# EAGLE design wt41_uart_breakout_board_v21 (EAGLE 6.5.0)
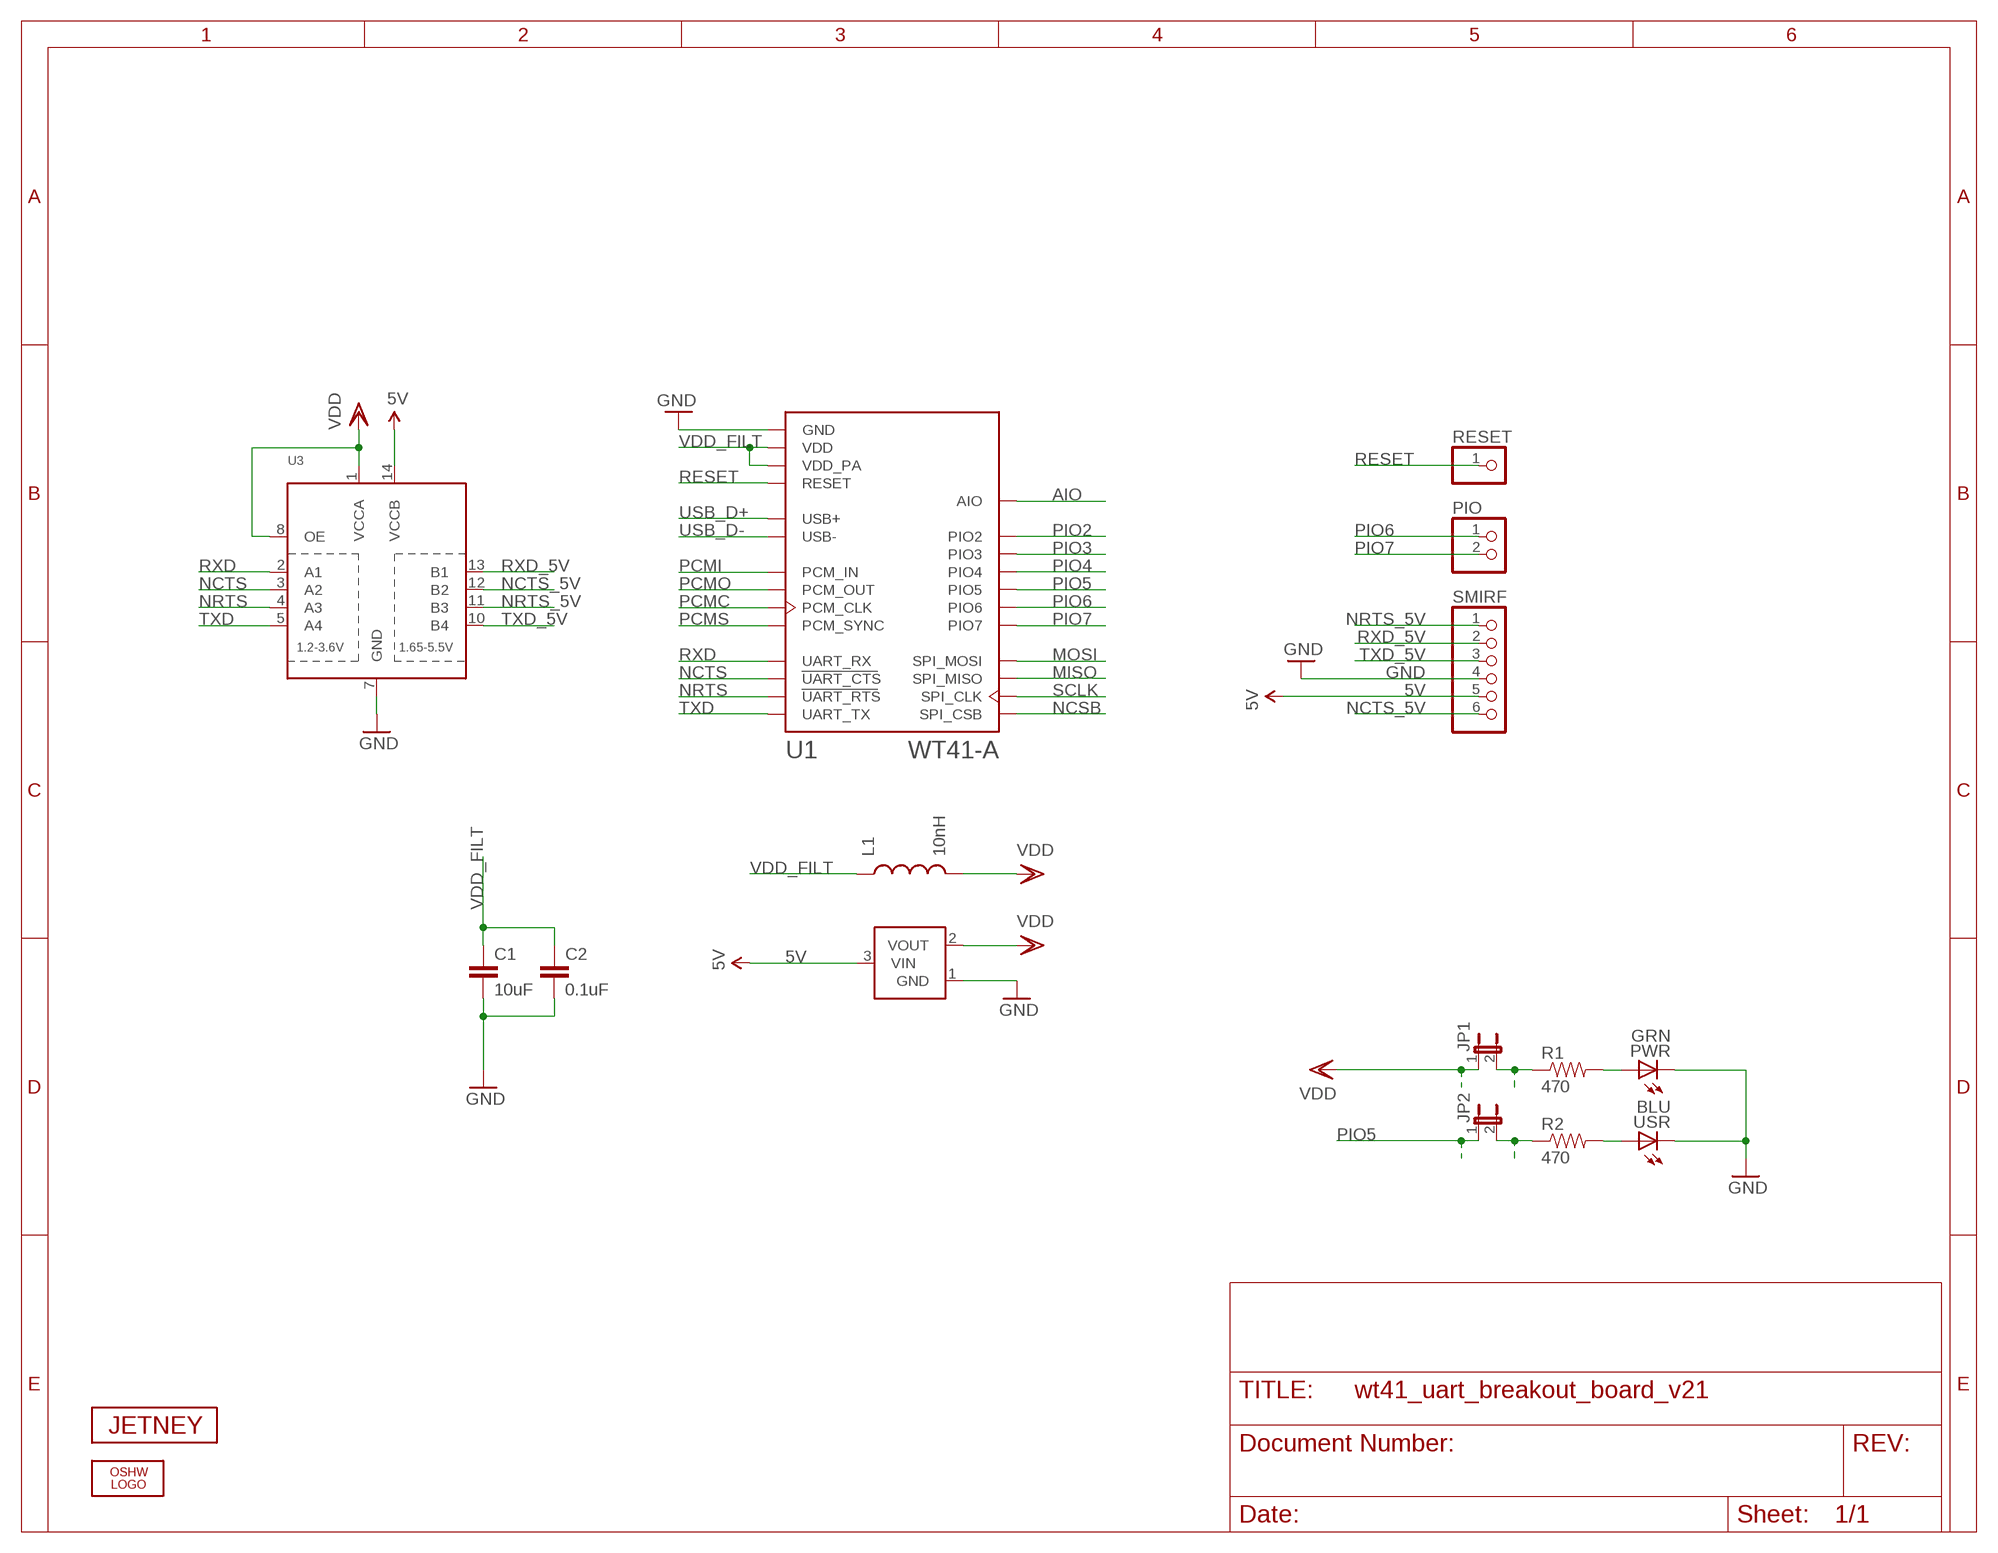
[diagram p0: schematic, sheet 1]

## Parts
C1  10uF  CAP0603-CAP  [0603-CAP]
C2  0.1uF  CAP0603-CAP  [0603-CAP]
JP1  JUMPER-2SMD-NC  [SJ_2S]
JP2  JUMPER-2SMD-NC  [SJ_2S]
L1  10nH  INDUCTOR0603  [0603]
LOGO1  OSHW_LOGO_FILLX0070-NT  [OSHW_FILLX70_NOTEXT]
PIO  PINHD-1X2  [1X02]
PWR  GRN  LEDCHIPLED_0805  [CHIPLED_0805]
R1  470  RESISTOR0603-RES  [0603-RES]
R2  470  RESISTOR0603-RES  [0603-RES]
RESET  PINHD-1X1  [1X01]
SMIRF  PINHD-1X6  [1X06]
U1  WT41-A  [WT41-A]
U2  MCP1700  [SOT23-3]
U3  TXB0104PWR  [TSSOP14]
U$4  JETNEY-LOGO-12  [JETNEY-LOGO-12]
USR  BLU  LEDCHIPLED_0805  [CHIPLED_0805]

## Nets
5V [power]: SMIRF.5 U2.3(VIN) U3.14(VCCB)
AIO: U1.AIO
GND [power]: C1.2 C2.2 PWR.C SMIRF.4 U1.GND U1.GND@2(GND) U1.GND@3(GND) U1.GND@4(GND) U1.GND@5(GND) U1.GND@6(GND) U1.GND@7(GND) U1.GND@8(GND) U1.GND@9(GND) U1.GND@10(GND) U1.GND@11(GND) U1.GND@12(GND) U1.GND@13(GND) U1.GND@14(GND) U1.GND@15(GND) U1.GND@16(GND) U1.GND@17(GND) U1.GND@18(GND) U1.GND@19(GND) U1.GND@20(GND) U1.GND@21(GND) U1.GND@22(GND) U1.GND@23(GND) U1.GND@24(GND) U1.GND@25(GND) U1.GND@26(GND) U1.GND@27(GND) U1.GND@28(GND) U1.GND@29(GND) U1.GND@30(GND) U1.GND@31(GND) U2.1(GND) U3.7(GND) USR.C
MISO: U1.SPI_MISO
MOSI: U1.SPI_MOSI
N$1: PWR.A R1.2
N$3: R2.2 USR.A
N$4: JP2.2 R2.1
NCSB: U1.SPI_CSB
NCTS: U1.UART_CTS U3.3(A2)
NCTS_5V: SMIRF.6 U3.12(B2)
NRTS: U1.UART_RTS U3.4(A3)
NRTS_5V: SMIRF.1 U3.11(B3)
PCMC: U1.PCM_CLK
PCMI: U1.PCM_IN
PCMO: U1.PCM_OUT
PCMS: U1.PCM_SYNC
PIO2: U1.PIO2
PIO3: U1.PIO3
PIO4: U1.PIO4
PIO5: JP2.1 U1.PIO5
PIO6: PIO.1 U1.PIO6
PIO7: PIO.2 U1.PIO7
RESET: RESET.1 U1.RESET
RXD: U1.UART_RX U3.2(A1)
RXD_5V: SMIRF.2 U3.13(B1)
SCLK: U1.SPI_CLK
TXD: U1.UART_TX U3.5(A4)
TXD_5V: SMIRF.3 U3.10(B4)
USB_D+: U1.USB+
USB_D-: U1.USB-
VDD [power]: JP1.1 L1.2 U2.2(VOUT) U3.1(VCCA) U3.8(OE)
VDD_FILT [power]: C1.1 C2.1 L1.1 U1.VDD U1.VDD_PA
VDDJP1 [power]: JP1.2 R1.1

## Library data of the parts
C1 C2 = SparkFun:CAP: Capacitor Standard 0603 ceramic capacitor, and 0.1" leaded capacitor.
JP1 JP2 = SparkFun:JUMPER-2: Jumper Basic 0.1" spaced jumper. Use with breakaway headers.
L1 = SparkFun:INDUCTOR: Inductors Basic Inductor/Choke - 0603 and 1206. Footprints are not proven and vary greatly between part numbers.
LOGO1 = oshw-logo:OSHW_LOGO_FILL
PIO = sf-pinhead:PINHD-1X2: PIN HEADER
PWR USR = adafruit:LED: LED OSRAM: - CHIPLED LG R971, LG N971, LY N971, LG Q971, LY Q971, LO R971, LY R971 LH N974, LH R974 LS Q976, LO Q976, LY Q976 LO Q996 - Hyper CHIPLED LW Q18S LB Q993, LB Q99A, LB R99A - SideLED LS A670, LO A670, LY A670, LG A670, LP A670 LB A673, LV A673, LT A673, LW A673 LH A674 LY A675 LS A676, LA A676, LO A676, LY A676, LW A676 LS A679, LY A679, LG A679 - Hyper Micro SIDELED® LS Y876, LA Y876, LO Y876, LY Y876 LT Y87S - SmartLED LW L88C, LW L88S LB L89C, LB L89S, LG L890 LS L89K, LO L89K, LY L89K LS L896, LA L896, LO L896, LY L896 - TOPLED LS T670, LO T670, LY T670, LG T670, LP T670 LSG T670, LSP T670, LSY T670, LOP T670, LYG T670 LG T671, LOG T671, LSG T671 LB T673, LV T673, LT T673, LW T673 LH T674 LS T676, LA T676, LO T676, LY T676, LB T676, LH T676, LSB T676, LW T676 LB T67C, LV T67C, LT T67C, LS T67K, LO T67K, LY T67K, LW E67C LS E67B, LA E67B, LO E67B, LY E67B, LB E67C, LV E67C, LT E67C LW T67C LS T679, LY T679, LG T679 LS T770, LO T770, LY T770, LG T770, LP T770 LB T773, LV T773, LT T773, LW T773 LH T774 LS E675, LA E675, LY E675, LS T675 LS T776, LA T776, LO T776, LY T776, LB T776 LHGB T686 LT T68C, LB T68C - Hyper Mini TOPLED® LB M676 - Mini TOPLED Santana® LG M470 LS M47K, LO M47K, LY M47K Source: http://www.osram.convergy.de/
R1 R2 = SparkFun:RESISTOR: Resistor Basic schematic elements and footprints for 0603, 1206, and PTH resistors.
RESET = sf-pinhead:PINHD-1X1: PIN HEADER
SMIRF = sf-pinhead:PINHD-1X6: PIN HEADER
U1 = sf-bluegiga:WT41: Bluegiga WT41 long-range Bluetooth module - Bluetooth 2.1 + EDR (+20 dBm, 1000m). WT41-A variant has an on-module ceramic chip antenna, WT41-E variant has a U.Fl connector. WT41-A variant should be mounted over a solid ground plane. Antenna edge of the module should be flush up agains the edge of the PCB. See datasheet for variant layout details. The WT41 is a fully integrated Bluetooth 2.1 + EDR, class 1 module combining antenna, Bluetooth radio, and an on-board iWRAP Bluetooth stack. The WT41 provides a superior 110dB link budget and more than 1000-meter line-of-sight connectivity for Bluetooth applications where extreme radio performance or reliability is required. It also constitutes an ideal solution for developers that want to quickly integrate extremely high performing Bluetooth wireless technology into their design without investing several months in Bluetooth radio and stack development. The WT41 uses Bluegiga's iWRAP Bluetooth stack, which is an embedded Bluetooth stack implementing 13 different Bluetooth profiles and Apple iAP connectivity. By using WT41 combined with iWRAP Bluetooth stack and Bluegiga's excellent technical support, designers ensure quick time-to-market, and low development costs and risks. http://www.bluegiga.com/en-US/products/bluetooth-classic-modules/wt41-long-range-bluetooth--module https://github.com/jrowberg/sf-oshw Last updated 2014-01-04 by Jeff Rowberg <jeff@rowberg.net>; ANTENNA: On-module ceramic chip antenna
U2 = nonolith:MCP1700: Voltage regulator
U3 = SparkFun-DigitalIC:TXB0104PWR: 4-Bit Bi-Directional Level Shifter 1.2V-3.6V (VCCA) to 1.65V-5.5V (VCCB) bi-directional level shifter with auto direction sensing. Max data rate - VCCA 1.8V: 20Mbps (50ns), VCCA 3.3V: 100Mbps (10ns) Digikey: 296-21929-1-ND (TSSOP) IC-11329
U$4 = sf-keyglove:JETNEY-LOGO

## Net classes
0 default: width 0.152 mm, drill 0.33 mm, clearance 0.152 mm
1 power: width 0.254 mm, drill 0.33 mm, clearance 0.152 mm

## Board
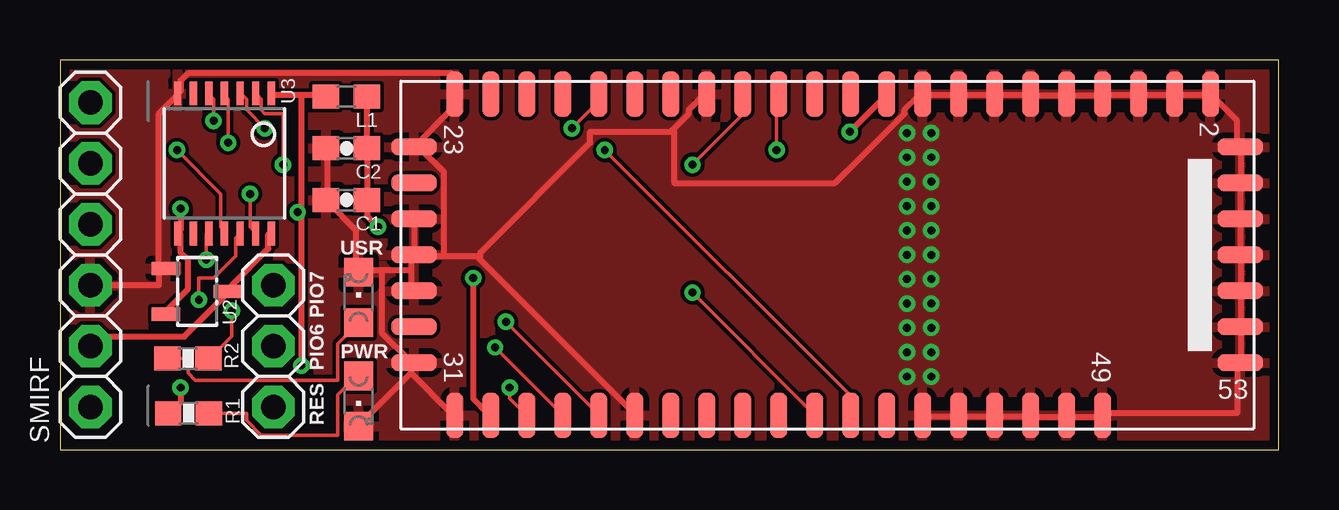
[diagram p1: board, top side]
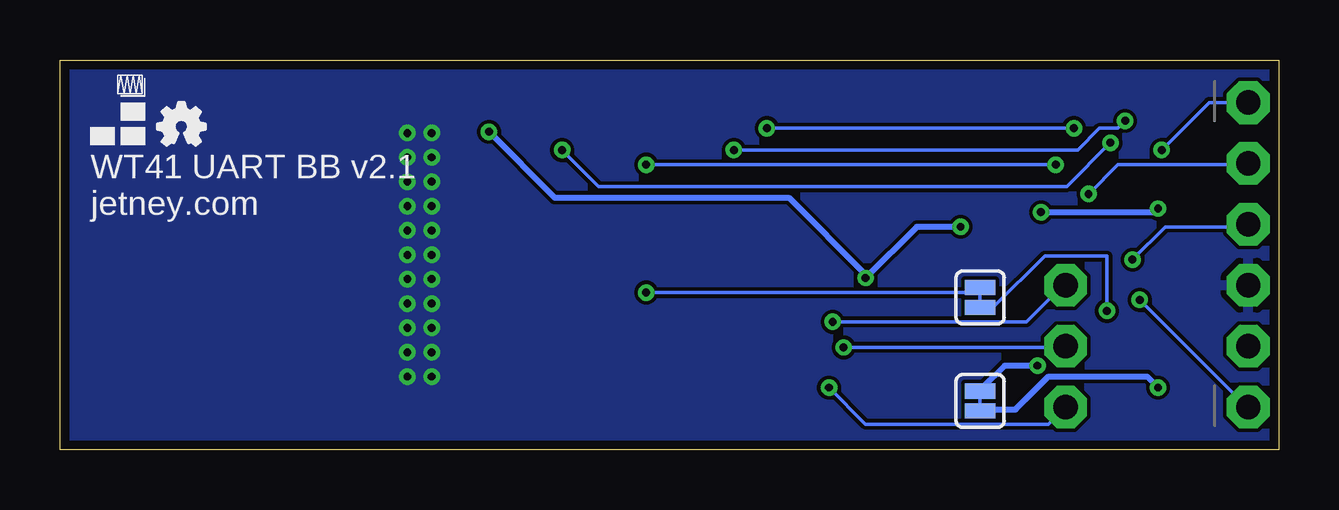
[diagram p2: board, bottom side, seen from below]

Size 50.8 x 16.26 mm. Coordinates in mm from the lower left corner, seen from the top.
Outline: 0,0 50.8,0 50.8,16.26 0,16.26 0,0
Copper layers (1*16): Top 0.0356mm / dielectric 1.5011mm / Bottom 0.0356mm
Design rules "LaenPCBOrder *": minimum track width 6mil, minimum drill 13mil, track to track 6mil, track to pad 6mil, pad to pad 6mil, via to via 6mil, smd to smd 6mil, copper to edge 15mil, drill to drill 6mil, minimum pad ring 7mil, minimum via ring 7mil, stop-mask expansion 4mil, vias tented up to drill 13mil, thermal gap 10mil
vRestrict: area 2.5,0.5 to 3.8,15.7; area 11.7,8.1 to 13.2,8.6; area 11.7,3.8 to 13.2,4.3; area 10.4,1 to 10.9,7.9

### Footprints (pad centres in the part's own frame; a part is rotated, then mirrored left to right if it is on the bottom)
0603-CAP = smd 1.1 x 1: 1 -0.85,0; 2 0.85,0
SJ_2S = smd 0.635 x 1.27: 1 -0.412,0; 2 0.412,0
0603 = smd 1.1 x 1: 1 -0.85,0; 2 0.85,0
1X02 = drill 1.016 pad 1.778 octagon: 1 -1.27,0; 2 1.27,0
CHIPLED_0805 = smd 1.2 x 1.2: A 0,-1.05; C 0,1.05
0603-RES = smd 1.1 x 1: 1 -0.85,0; 2 0.85,0
1X01 = drill 1.016 pad 1.778 octagon: 1 0,0
1X06 = drill 1.016 pad 1.778 octagon: 1 -6.35,0; 2 -3.81,0; 3 -1.27,0; 4 1.27,0; 5 3.81,0; 6 6.35,0
WT41-A = smd 1.9 x 0.7: AIO 6.7,2.45; GND -6.7,15.95; GND@2 -6.7,14.45; GND@3 -6.7,12.95; GND@4 -6.7,11.45; GND@5 -6.7,9.95; GND@6 -6.7,8.45; GND@7 -6.7,6.95; GND@8 -6.7,5.45; GND@9 -6.7,3.95; GND@10 -6.7,-5.05; GND@11 -6.7,-15.55; GND@17 6.7,-15.55; GND@18 6.7,-8.05; GND@19 6.7,3.95; GND@20 6.7,5.45; GND@21 6.7,6.95; GND@22 6.7,8.45; GND@23 6.7,9.95; GND@24 6.7,11.45; PCM_CLK -6.7,-12.55; PCM_IN -6.7,-11.05; PCM_SYNC -6.7,-14.05; PIO2 -6.7,0.95; PIO3 -6.7,-0.55; PIO5 6.7,-0.55; PIO6 6.7,-11.05; PIO7 6.7,-9.55; RESET 6.7,-12.55; SPI_CLK 6.7,-5.05; SPI_CSB 6.7,-6.55; SPI_MISO 6.7,-3.55; SPI_MOSI 6.7,-2.05; UART_CTS -6.7,-9.55; UART_RTS -6.7,-2.05; UART_RX -6.7,-3.55; UART_TX 6.7,0.95; USB+ -6.7,-6.55; USB- -6.7,-8.05; VDD 6.7,-14.05; VDD_PA -6.7,2.45 | smd 0.7 x 1.9: GND@12 -4.5,-17.25; GND@13 -1.5,-17.25; GND@14 0,-17.25; GND@15 1.5,-17.25; GND@16 4.5,-17.25; GND@25 4.5,17.2; GND@26 3,17.2; GND@27 1.5,17.2; GND@28 0,17.2; GND@29 -1.5,17.2; GND@30 -3,17.2; GND@31 -4.5,17.2; PCM_OUT -3,-17.25; PIO4 3,-17.25
SOT23-3 = smd 0.55 x 1.2: 1 0.95,1.3; 2 -0.95,1.3; 3 0,-1.3
TSSOP14 = smd 0.305 x 0.991: 1 -1.95,-2.918; 2 -1.3,-2.918; 3 -0.65,-2.918; 4 0,-2.918; 5 0.65,-2.918; 6 1.3,-2.918; 7 1.95,-2.918; 8 1.95,2.918; 9 1.3,2.918; 10 0.65,2.918; 11 0,2.918; 12 -0.65,2.918; 13 -1.3,2.918; 14 -1.95,2.918

### Placement (x,y rotation side)
C1  11.94,10.41 180 top
C2  11.94,12.57 180 top
JP1  12.45,2.03 270 bottom
JP2  12.45,6.35 270 bottom
L1  11.94,14.73 180 top
LOGO1  46.74,12.7 0 bottom
PIO  8.89,5.59 90 top
PWR  12.45,2.03 180 top
R1  5.36,1.52 0 top
R2  5.33,3.81 180 top
RESET  8.89,1.78 0 top
SMIRF  1.27,8.13 270 top
U1  32,8.13 270 top
U2  5.71,6.6 90 top
U3  6.86,11.94 180 top
U$4  49.53,12.7 0 bottom
USR  12.45,6.35 0 top

### Tracks (layer width: path | path; a pad name or v marks a point on that pad's centre or on a via)
5V
  Top 0.254: U3.14 8.69,8.99 8.69,8.38 7.16,6.86 7.16,6.71 U2.3 7.01,6.55 5.18,4.72 1.37,4.72 1.37,4.42 SMIRF.5
GND  (via drill 0.33)
  Top 0.254: U1.GND@19 35.97,1.37 37.34,1.37 U1.GND@20 37.49,1.37 38.86,1.37 U1.GND@21 39.01,1.37 40.39,1.37 U1.GND@22 40.54,1.37 41.91,1.37 U1.GND@23 42.06,1.37 43.43,1.37 U1.GND@24 43.59,1.52 49.07,1.52 49.07,3.5 U1.GND@25 49.23,3.66 49.23,5.03 U1.GND@26 49.23,5.18 49.23,6.55 U1.GND@27 49.23,6.71 49.23,8.08 U1.GND@28 49.23,8.23 49.23,9.6 U1.GND@29 49.23,9.75 49.23,11.12 U1.GND@30 49.23,11.28 49.23,12.5 U1.GND@31 | 49.23,12.65 U1.GND@31 | U1.GND@31 49.07,12.65 49.07,13.72 48.01,14.78 U1.GND 47.85,14.78 46.48,14.78 U1.GND@2 46.33,14.78 44.96,14.78 U1.GND@3 44.81,14.78 43.59,14.78 U1.GND@4 43.43,14.78 42.06,14.78 U1.GND@5 41.91,14.78 40.54,14.78 U1.GND@6 40.39,14.78 39.01,14.78 U1.GND@7 38.86,14.78 37.49,14.78 U1.GND@8 37.34,14.78 35.97,14.78 U1.GND@9 35.81,14.78 35.2,14.17 35.2,14.02 32.31,11.12 25.6,11.12 25.6,13.26 25.53,13.34 | U2.1 4.27,7.62 4.12,7.77 4.12,14.02 4.88,14.78 U3.7 5.03,14.94 5.03,15.39 5.33,15.7 16.31,15.7 16.31,14.94 U1.GND@11 | 4.42,7.62 U2.1 | SMIRF.4 4.12,6.86 4.12,7.62 U2.1 | 16.46,1.37 U1.GND@17 16.31,1.52 14.63,3.2 | 14.63,3.2 12.5,1.07 PWR.C | 14.63,3.2 14.63,3.5 U1.GND@16 | 14.78,3.66 U1.GND@16 | U1.GND@11 16.31,14.78 16.31,14.17 14.78,12.65 U1.GND@12 14.94,12.65 16,11.58 16,8.08 | 16.46,14.78 U1.GND@11 | 26.98,14.78 U1.GND@10 26.82,14.78 26.21,14.17 26.21,14.02 25.53,13.34 | 23.93,1.37 U1.GND@18 23.93,1.52 17.45,8 | 14.78,6.71 U1.GND@15 14.63,6.71 14.63,7.47 | C2.2 11.12,12.5 11.12,10.52 C1.2 11.12,10.36 12.34,9.14 12.34,7.47 USR.C 12.5,7.47 13.41,7.47 | 14.63,7.47 13.41,7.47 | 14.63,7.47 14.63,8.08 U1.GND@14 | U1.GND@13 14.78,9.6 14.78,8.23 U1.GND@14
  Top 0.254: 17.45,8 17.37,8.08 16,8.08 | 16,8.08 14.78,8.08 U1.GND@14 | 25.53,13.34 25.45,13.26 22.1,13.26 22.1,12.8 17.53,8.23 17.53,8.08 17.45,8 | 13.41,7.47 13.41,4.88 14.63,3.66 U1.GND@16
  other vias: 35.31,3.05 35.31,4.06 35.31,5.08 35.31,6.1 35.31,7.11 35.31,8.13 35.31,9.14 35.31,10.16 35.31,11.18 35.31,12.19 35.31,13.21 36.32,13.21 36.32,12.19 36.32,11.18 36.32,10.16 36.32,9.14 36.32,8.13 36.32,7.11 36.32,6.1 36.32,5.08 36.32,4.06 36.32,3.05
  pour Top: 0,16.26 50.8,16.26 50.8,0 0,0
  pour Bottom: 0,16.26 50.8,16.26 50.8,0 0,0
N$1
  Top 0.152: R1.2 7.77,1.52 7.77,1.22 8.38,0.61 11.58,0.61 11.58,2.29 12.34,3.05 PWR.A
N$3
  Top 0.152: R2.2 5.33,3.81 5.33,3.2 5.64,2.9 11.58,2.9 11.58,4.42 12.34,5.18 USR.A
N$4  (via drill 0.33)
  Top 0.152: v7.16,5.79 7.16,4.72 6.25,3.81 R2.1
  Bottom 0.152: v7.16,5.79 7.16,8.08 9.75,8.08 11.89,5.94 12.34,5.94 JP2.2
N$5
  Bottom 0.152: 12.45,1.78 12.45,2.29
N$6
  Bottom 0.152: 12.45,6.1 12.45,6.6
NCTS  (via drill 0.33)
  Top 0.152: v8.53,13.41 7.77,14.17 7.77,14.63 7.62,14.78 U3.3 | v21.34,13.41 22.4,14.48 22.4,14.78 U1.UART_CTS
  Bottom 0.152: v21.34,13.41 v8.53,13.41
NCTS_5V  (via drill 0.33)
  Top 0.152: v5.79,6.25 5.79,7.16 6.4,7.16 7.32,8.08 7.32,8.84 7.47,8.99 U3.12
  Bottom 0.152: v5.79,6.25 1.37,1.83 SMIRF.6
NRTS  (via drill 0.33)
  Top 0.152: v7.01,12.8 7.01,14.63 6.86,14.78 U3.4 | v29.87,12.5 29.87,14.78 U1.UART_RTS
  Bottom 0.152: v7.01,12.8 8.84,10.97 28.35,10.97 v29.87,12.5
NRTS_5V  (via drill 0.33)
  Top 0.152: v4.88,12.5 6.71,10.67 6.71,9.3 6.86,9.14 U3.11
  Bottom 0.152: v4.88,12.5 2.9,14.48 SMIRF.1
PIO5  (via drill 0.33)
  Top 0.152: v26.36,6.55 31.39,1.52 U1.PIO5
  Bottom 0.152: v26.36,6.55 12.65,6.55 12.5,6.71 JP2.1
PIO6  (via drill 0.33)
  Top 0.152: v18.14,4.27 20.88,1.52 U1.PIO6
  Bottom 0.152: v18.14,4.27 8.99,4.27 PIO.1
PIO7  (via drill 0.33)
  Top 0.152: v18.59,5.33 22.4,1.52 U1.PIO7
  Bottom 0.152: v18.59,5.33 10.52,5.33 8.99,6.86 PIO.2
RESET  (via drill 0.33)
  Top 0.152: v18.75,2.59 18.75,2.13 19.36,1.52 U1.RESET
  Bottom 0.152: v18.75,2.59 17.22,1.07 9.6,1.07 RESET.1
RXD  (via drill 0.33)
  Top 0.152: v9.3,11.89 9.3,14.02 8.53,14.02 8.38,14.17 8.38,14.63 8.23,14.78 U3.2 | v26.36,11.89 28.35,13.87 28.35,14.78 U1.UART_RX
  Bottom 0.152: v26.36,11.89 v9.3,11.89
RXD_5V  (via drill 0.33)
  Top 0.152: v7.92,10.67 7.92,9.3 8.08,9.14 U3.13
  Bottom 0.152: v7.92,10.67 6.71,11.89 1.37,11.89 SMIRF.2
TXD  (via drill 0.33)
  Top 0.152: v6.4,13.72 6.4,14.63 6.25,14.78 U3.5 | v22.71,12.5 32.92,2.29 32.92,1.52 U1.UART_TX
  Bottom 0.152: v6.4,13.72 6.71,13.41 7.47,13.41 8.38,12.5 v22.71,12.5
TXD_5V  (via drill 0.33)
  Top 0.152: v6.1,7.92 6.1,8.99 U3.10
  Bottom 0.152: v6.1,7.92 4.72,9.3 1.37,9.3 SMIRF.3
VDD  (via drill 0.33)
  Top 0.254: U2.2 4.42,5.79 5.33,6.71 5.33,7.92 5.03,8.23 5.03,8.99 U3.8 5.03,9.14 v5.03,10.06 | 10.06,14.78 10.97,14.78 L1.2 | 10.06,14.78 8.84,14.78 U3.1 | 10.06,14.78 10.06,9.91 | 10.06,9.91 v10.06,3.5 | 10.06,9.91 v9.91,9.91
  Bottom 0.254: v10.06,3.5 11.43,3.5 12.34,2.59 JP1.1 | v5.03,10.06 5.18,9.91 v9.91,9.91
VDD_FILT  (via drill 0.33)
  Top 0.254: L1.1 12.8,14.63 12.8,12.65 C2.1 12.8,12.5 12.8,10.52 C1.1 12.8,10.36 12.8,9.75 v13.26,9.3 | v17.22,7.16 17.22,2.13 17.83,1.52 U1.VDD | v32.92,13.26 34.44,14.78 U1.VDD_PA
  Bottom 0.254: v13.26,9.3 15.09,9.3 v17.22,7.16 17.22,7.32 20.42,10.52 30.18,10.52 v32.92,13.26
VDDJP1  (via drill 0.33)
  Top 0.254: v5.03,2.59 5.03,1.98 4.57,1.52 R1.1
  Bottom 0.254: v5.03,2.59 5.49,3.05 9.6,3.05 10.97,1.68 12.34,1.68 JP1.2

### Text on the board
tPlace: PIO6 PIO7 | RES
bPlace: WT41 UART BB v2.1 | jetney.com
tDocu: RTS RXD TXD GND VCC CTS | Bluegiga / WT41-A
bDocu: RTS RXD TXD GND VCC CTS | PIO5 | PWR